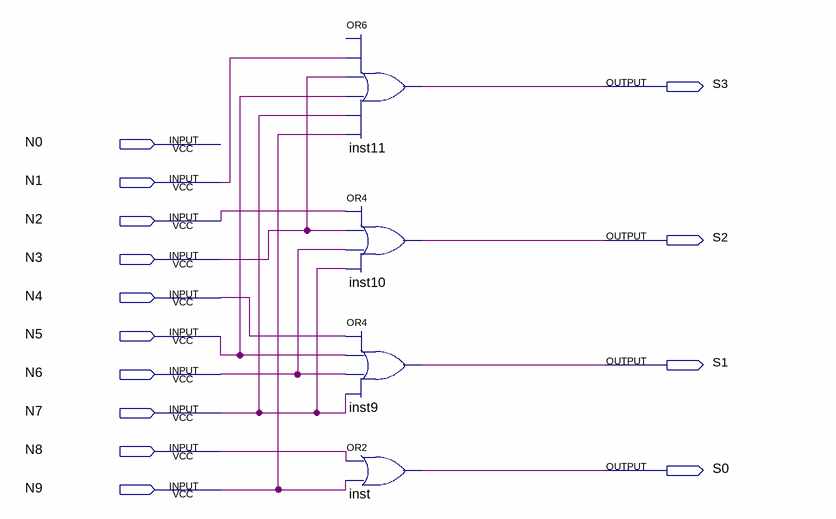
[diagram p0: schematic sheet]
// Quartus schematic codificadorteclado_esq.bdf as structural Verilog: 4 symbols, 14 pins
module codificadorteclado_esq (
  input  N0,
  input  N1,
  input  N2,
  input  N3,
  input  N4,
  input  N5,
  input  N6,
  input  N7,
  input  N8,
  input  N9,
  output S3,
  output S2,
  output S1,
  output S0
);

  or inst11 (S3, N1, N3, N5, N7, N9);  // open: IN1
  or inst10 (S2, N2, N3, N6, N7);
  or inst9 (S1, N4, N5, N6, N7);
  or inst (S0, N8, N9);
endmodule
